# EAGLE schematic power sply (EAGLE 9.6.2)
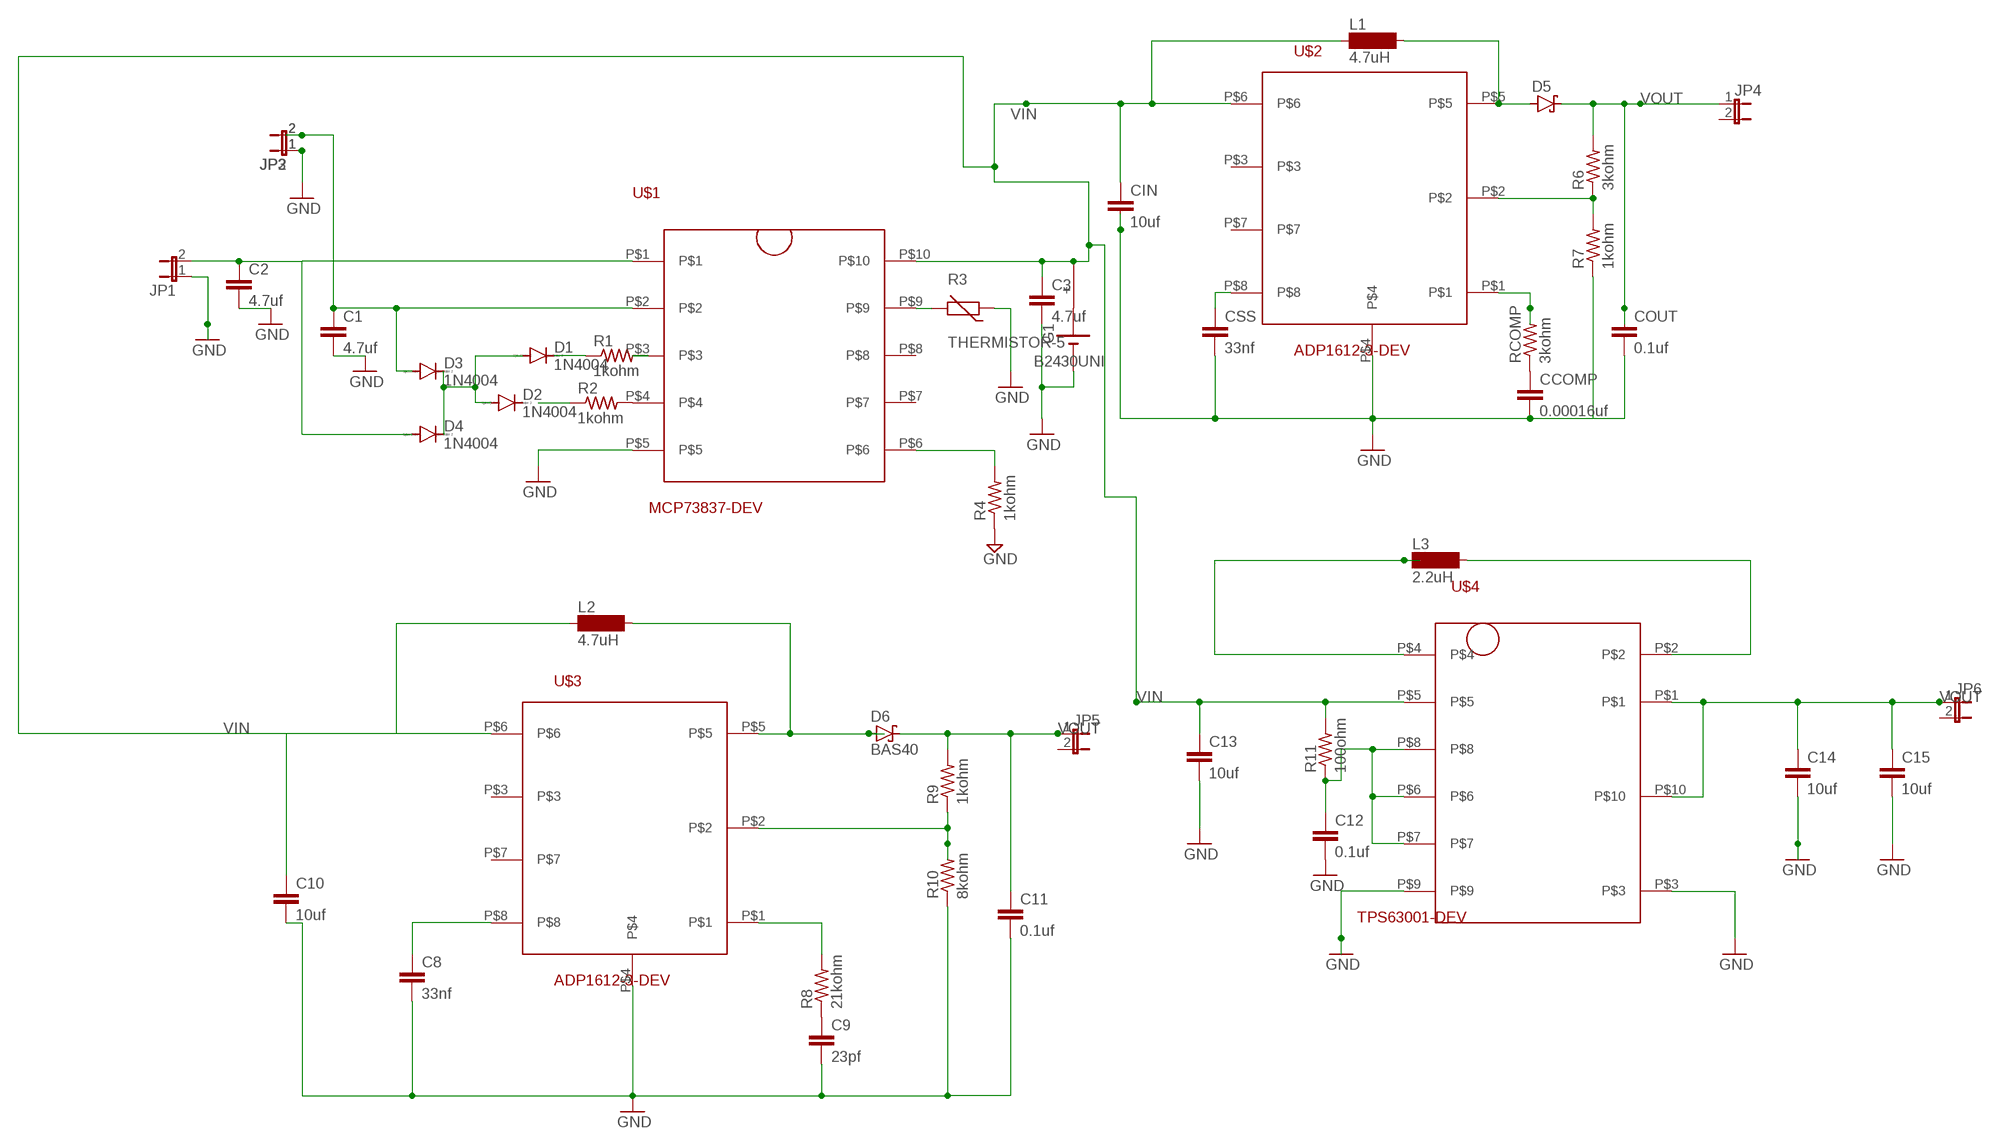
[diagram p0: schematic, sheet 1]

## Parts
C1  4.7uf  C2,5-3  [C2.5-3]
C2  4.7uf  C2,5-3  [C2.5-3]
C3  4.7uf  C2,5-3  [C2.5-3]
C8  33nf  C2,5-3  [C2.5-3]
C9  23pf  C2,5-3  [C2.5-3]
C10  10uf  C2,5-3  [C2.5-3]
C11  0.1uf  C2,5-3  [C2.5-3]
C12  0.1uf  C2,5-3  [C2.5-3]
C13  10uf  C2,5-3  [C2.5-3]
C14  10uf  C2,5-3  [C2.5-3]
C15  10uf  C2,5-3  [C2.5-3]
CCOMP  0.00016uf  C2,5-3  [C2.5-3]
CIN  10uf  C2,5-3  [C2.5-3]
COUT  0.1uf  C2,5-3  [C2.5-3]
CSS  33nf  C2,5-3  [C2.5-3]
D1  1N4004  [DO41-10]
D2  1N4004  [DO41-10]
D3  1N4004  [DO41-10]
D4  1N4004  [DO41-10]
D5  BAS40  [SOT23]
D6  BAS40  [SOT23]
G1  B2430UNI  [B2430UNI]
JP1  JP1E  [JP1]
JP2  JP1E  [JP1]
JP3  JP1E  [JP1]
JP4  JP1E  [JP1]
JP5  JP1E  [JP1]
JP6  JP1E  [JP1]
L1  4.7uH  MS42  [MS42]
L2  4.7uH  MS42  [MS42]
L3  2.2uH  BS11  [BS11]
R1  1kohm  R-US_0204/2V  [0204V]
R2  1kohm  R-US_0204/2V  [0204V]
R3  THERMISTOR-5  [R-5]
R4  1kohm  R-US_0204/2V  [0204V]
R6  3kohm  R-US_0204/2V  [0204V]
R7  1kohm  R-US_0204/2V  [0204V]
R8  21kohm  R-US_0204/2V  [0204V]
R9  1kohm  R-US_0204/2V  [0204V]
R10  8kohm  R-US_0204/2V  [0204V]
R11  100ohm  R-US_0204/2V  [0204V]
RCOMP  3kohm  R-US_0204/2V  [0204V]
U$1  MCP73837-DEV  [MCP73837-FOOT]
U$2  ADP1612-3-DEV  [ADP1612-3-FOOT]
U$3  ADP1612-3-DEV  [ADP1612-3-FOOT]
U$4  TPS63001-DEV  [TPS63001-FOOT]

## Nets
GND: C1.2 C2.2 C3.2 C8.2 C9.2 C10.2 C11.2 C12.2 C13.2 C14.2 C15.2 CCOMP.2 CIN.2 COUT.2 CSS.2 G1.- JP1.1 JP2.1 JP3.1 R3.1 R4.1 R10.1 U$1.P$5 U$2.P$4 U$3.P$4 U$4.P$3 U$4.P$9
N$1: C2.1 D4.A JP1.2 U$1.P$1
N$2: C1.1 D3.A JP2.2 JP3.2 U$1.P$2
N$3: R1.2 U$1.P$3
N$4: D1.C R1.1
N$5: R2.1
N$6: R2.2 U$1.P$4
N$8: R3.2 U$1.P$9
N$9: D1.A D2.A D3.C D4.C
N$10: R4.2 U$1.P$6
N$11: C9.1 R8.1
N$13: CSS.1 U$2.P$8
N$14: RCOMP.2 U$2.P$1
N$15: CCOMP.1 RCOMP.1
N$16: R6.1 R7.2 U$2.P$2
N$17: D5.1(A) L1.2 U$2.P$5
N$19: R9.1 R10.2 U$3.P$2
N$20: R7.1
N$21: D6.1(A) L2.2 U$3.P$5
N$23: C8.1 U$3.P$8
N$24: L3.1 U$4.P$4
N$25: R8.2 U$3.P$1
N$29: C12.1 R11.1 U$4.P$6 U$4.P$7 U$4.P$8
N$30: L3.2 U$4.P$2
VIN: C3.1 C10.1 C13.1 CIN.1 G1.+ L1.1 L2.1 R11.2 U$1.P$10 U$2.P$6 U$3.P$6 U$4.P$5
VOUT: C11.1 C14.1 C15.1 COUT.1 D5.3(C) D6.3(C) JP4.1 JP5.1 JP6.1 R6.2 R9.2 U$4.P$1 U$4.P$10
Unconnected: D2.C G1.+@1(+) G1.+@2(+) G1.+@3(+) G1.+@4(+) G1.-@1(-) JP4.2 JP5.2 JP6.2 U$1.P$7 U$1.P$8 U$2.P$3 U$2.P$7 U$3.P$3 U$3.P$7

## Library data of the parts
C1-C3 C8-C15 CCOMP CIN COUT CSS = capacitor-wima:C: CAPACITOR naming: grid - package width
D1-D4 = diode:1N4004: DIODE general purpose rectifier, 1 A
D5 D6 = diode:BAS40: Silicon Schottky Diodes General-purpose diode for high-speed switching
G1 = battery:B2430UNI: LI BATTERY
JP1-JP6 = jumper:JP1E: JUMPER
L1 L2 = inductor-neosid:MS42: INDUCTOR SMD inductor; OC_FARNELL: unknown; OC_NEWARK: unknown
L3 = inductor-neosid:BS: INDUCTOR nominal inductance, magnetically screened; OC_FARNELL: unknown; OC_NEWARK: unknown
R1 R2 R4 R6-R11 RCOMP = rcl:R-US_: RESISTOR, American symbol; SPICEPREFIX: R
R3 = varistor:THERMISTOR: THERMISTOR
U$1 = mcp73837:MCP73837-DEV
U$2 U$3 = adp1612-3:ADP1612-3-DEV
U$4 = tps63001:TPS63001-DEV